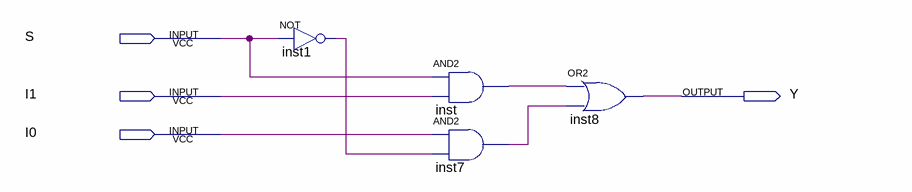
[diagram p0: schematic sheet]
// Quartus schematic MUX_2_1.bdf as structural Verilog: 4 symbols, 4 pins
module MUX_2_1 (
  input  S,
  input  I1,
  input  I0,
  output Y
);

  wire inst1_out, inst7_out, inst_out;

  not inst1 (inst1_out, S);
  and inst (inst_out, S, I1);
  and inst7 (inst7_out, I0, inst1_out);
  or inst8 (Y, inst_out, inst7_out);
endmodule
